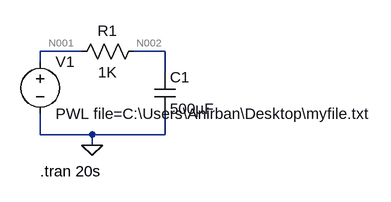
[diagram p0: schematic RCtest.asc]
RCtest.asc, the LTspice schematic file:
Version 4
SHEET 1 880 680
WIRE 112 112 48 112
WIRE 240 112 192 112
WIRE 48 128 48 112
WIRE 240 144 240 112
WIRE 48 240 48 208
WIRE 128 240 48 240
WIRE 240 240 240 208
WIRE 240 240 128 240
WIRE 128 256 128 240
FLAG 128 256 0
SYMBOL res 208 96 R90
WINDOW 0 0 56 VBottom 2
WINDOW 3 32 56 VTop 2
SYMATTR InstName R1
SYMATTR Value 1K
SYMBOL cap 224 144 R0
SYMATTR InstName C1
SYMATTR Value 500µF
SYMBOL voltage 48 112 R0
WINDOW 123 0 0 Left 0
WINDOW 39 0 0 Left 0
SYMATTR InstName V1
SYMATTR Value PWL file=C:\Users\Anirban\Desktop\myfile.txt
TEXT 48 296 Left 2 !.tran 20s

The netlist it stands for:
* RCtest.asc
R1 N002 N001 1K
C1 N002 0 500µF
V1 N001 0 PWL file=C:\Users\Anirban\Desktop\myfile.txt
.tran 20s
.backanno
.end

* Results of the author's LTspice run, read from the files saved beside the schematic
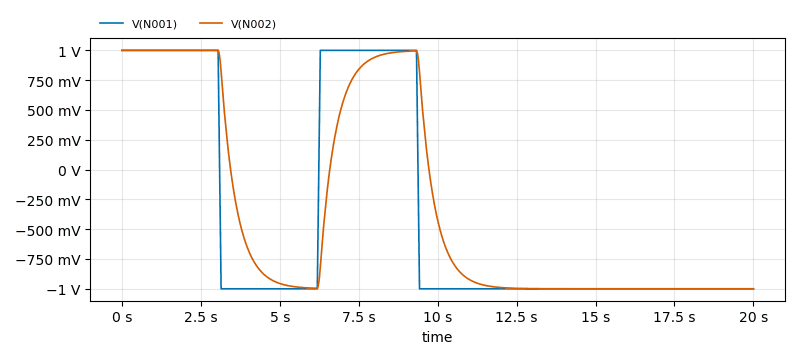
[diagram p1: Transient Analysis of RCtest.asc, plotted from the saved traces]
* Transient Analysis, 1 run:
*   V(N001): min -1 V, max 1 V, average -376.4 mV, rms 995.4 mV, last -1 V
*   V(N002): min -1 V, max 1 V, average -326.4 mV, rms 922.2 mV, last -1 V